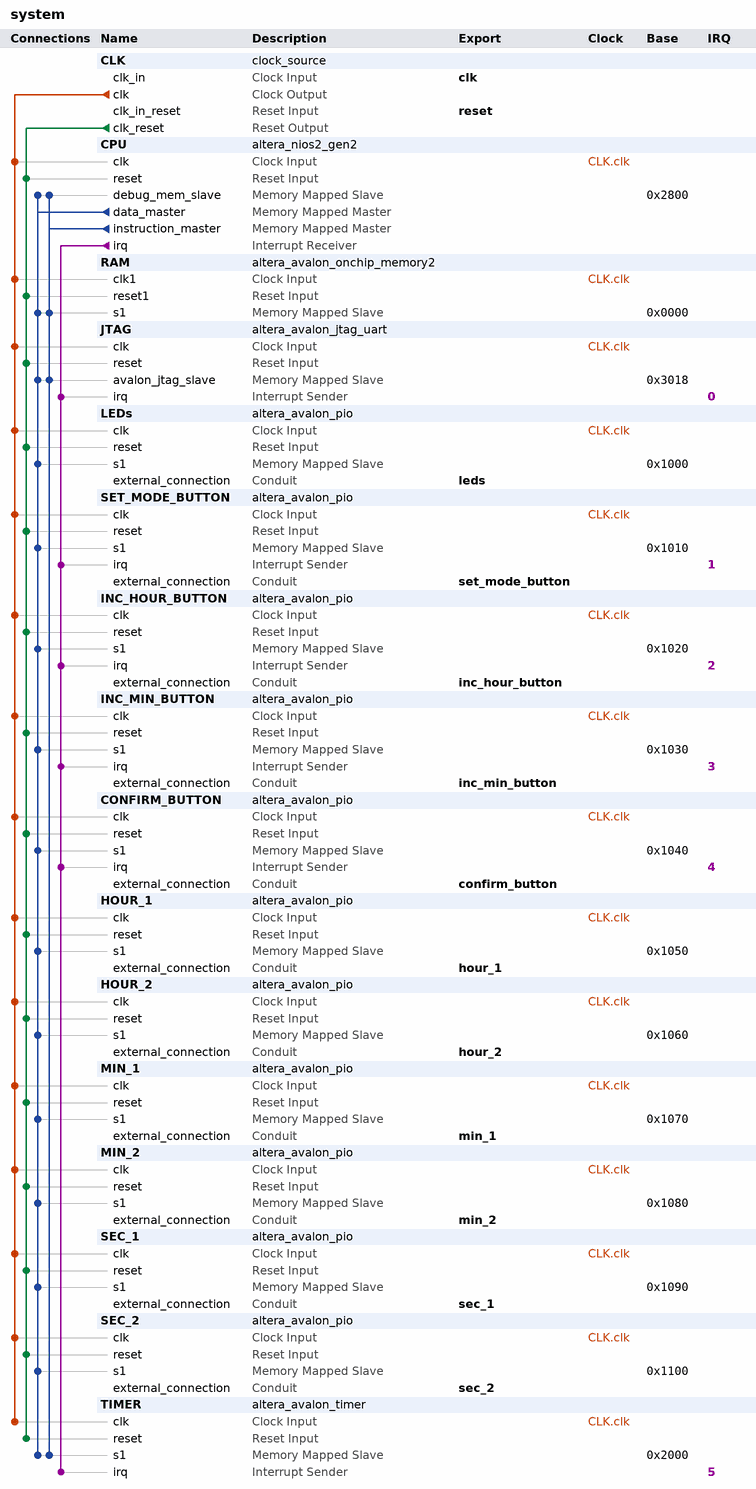
[diagram p0: system contents]
# Platform Designer (Qsys) system system, Cyclone V 5CSEMA5F31C6
# Parameters at their usual value, and those the tool derives, are not listed.
package require -exact qsys 19.1
create_system system
set_project_property DEVICE_FAMILY {Cyclone V}
set_project_property DEVICE 5CSEMA5F31C6

add_instance CLK clock_source 19.1
set_instance_parameter_value CLK clockFrequency 50000000

add_instance CPU altera_nios2_gen2 19.1
set_instance_parameter_value CPU dcache_size 2048
set_instance_parameter_value CPU exceptionSlave RAM.s1
set_instance_parameter_value CPU icache_size 4096
set_instance_parameter_value CPU impl Tiny
set_instance_parameter_value CPU resetSlave RAM.s1

add_instance RAM altera_avalon_onchip_memory2 19.1
set_instance_parameter_value RAM dataWidth 32
set_instance_parameter_value RAM dualPort false
set_instance_parameter_value RAM initMemContent true
set_instance_parameter_value RAM initializationFileName E:/ClockAlarm/software/clock_alarm/mem_init/system_RAM.hex
set_instance_parameter_value RAM memorySize 4096

add_instance JTAG altera_avalon_jtag_uart 19.1
set_instance_parameter_value JTAG simInteractiveOptions NO_INTERACTIVE_WINDOWS

add_instance LEDs altera_avalon_pio 19.1
set_instance_parameter_value LEDs direction Output
set_instance_parameter_value LEDs width 10

add_instance SET_MODE_BUTTON altera_avalon_pio 19.1
set_instance_parameter_value SET_MODE_BUTTON captureEdge true
set_instance_parameter_value SET_MODE_BUTTON direction Input
set_instance_parameter_value SET_MODE_BUTTON edgeType FALLING
set_instance_parameter_value SET_MODE_BUTTON generateIRQ true
set_instance_parameter_value SET_MODE_BUTTON irqType EDGE
set_instance_parameter_value SET_MODE_BUTTON width 1

add_instance INC_HOUR_BUTTON altera_avalon_pio 19.1
set_instance_parameter_value INC_HOUR_BUTTON captureEdge true
set_instance_parameter_value INC_HOUR_BUTTON direction Input
set_instance_parameter_value INC_HOUR_BUTTON edgeType FALLING
set_instance_parameter_value INC_HOUR_BUTTON generateIRQ true
set_instance_parameter_value INC_HOUR_BUTTON irqType EDGE
set_instance_parameter_value INC_HOUR_BUTTON width 1

add_instance INC_MIN_BUTTON altera_avalon_pio 19.1
set_instance_parameter_value INC_MIN_BUTTON captureEdge true
set_instance_parameter_value INC_MIN_BUTTON direction Input
set_instance_parameter_value INC_MIN_BUTTON edgeType FALLING
set_instance_parameter_value INC_MIN_BUTTON generateIRQ true
set_instance_parameter_value INC_MIN_BUTTON irqType EDGE
set_instance_parameter_value INC_MIN_BUTTON width 1

add_instance CONFIRM_BUTTON altera_avalon_pio 19.1
set_instance_parameter_value CONFIRM_BUTTON captureEdge true
set_instance_parameter_value CONFIRM_BUTTON direction Input
set_instance_parameter_value CONFIRM_BUTTON edgeType FALLING
set_instance_parameter_value CONFIRM_BUTTON generateIRQ true
set_instance_parameter_value CONFIRM_BUTTON irqType EDGE
set_instance_parameter_value CONFIRM_BUTTON width 1

add_instance HOUR_1 altera_avalon_pio 19.1
set_instance_parameter_value HOUR_1 direction Output
set_instance_parameter_value HOUR_1 width 7

add_instance HOUR_2 altera_avalon_pio 19.1
set_instance_parameter_value HOUR_2 direction Output
set_instance_parameter_value HOUR_2 width 7

add_instance MIN_1 altera_avalon_pio 19.1
set_instance_parameter_value MIN_1 direction Output
set_instance_parameter_value MIN_1 width 7

add_instance MIN_2 altera_avalon_pio 19.1
set_instance_parameter_value MIN_2 direction Output
set_instance_parameter_value MIN_2 width 7

add_instance SEC_1 altera_avalon_pio 19.1
set_instance_parameter_value SEC_1 direction Output
set_instance_parameter_value SEC_1 width 7

add_instance SEC_2 altera_avalon_pio 19.1
set_instance_parameter_value SEC_2 direction Output
set_instance_parameter_value SEC_2 width 7

add_instance TIMER altera_avalon_timer 19.1
set_instance_parameter_value TIMER alwaysRun true
set_instance_parameter_value TIMER fixedPeriod true
set_instance_parameter_value TIMER period 1
set_instance_parameter_value TIMER periodUnits SEC

# connections
add_connection CLK.clk CONFIRM_BUTTON.clk clock
add_connection CLK.clk CPU.clk clock
add_connection CLK.clk HOUR_1.clk clock
add_connection CLK.clk HOUR_2.clk clock
add_connection CLK.clk INC_HOUR_BUTTON.clk clock
add_connection CLK.clk INC_MIN_BUTTON.clk clock
add_connection CLK.clk JTAG.clk clock
add_connection CLK.clk LEDs.clk clock
add_connection CLK.clk MIN_1.clk clock
add_connection CLK.clk MIN_2.clk clock
add_connection CLK.clk RAM.clk1 clock
add_connection CLK.clk SEC_1.clk clock
add_connection CLK.clk SEC_2.clk clock
add_connection CLK.clk SET_MODE_BUTTON.clk clock
add_connection CLK.clk TIMER.clk clock
add_connection CLK.clk_reset CONFIRM_BUTTON.reset reset
add_connection CLK.clk_reset CPU.reset reset
add_connection CLK.clk_reset HOUR_1.reset reset
add_connection CLK.clk_reset HOUR_2.reset reset
add_connection CLK.clk_reset INC_HOUR_BUTTON.reset reset
add_connection CLK.clk_reset INC_MIN_BUTTON.reset reset
add_connection CLK.clk_reset JTAG.reset reset
add_connection CLK.clk_reset LEDs.reset reset
add_connection CLK.clk_reset MIN_1.reset reset
add_connection CLK.clk_reset MIN_2.reset reset
add_connection CLK.clk_reset RAM.reset1 reset
add_connection CLK.clk_reset SEC_1.reset reset
add_connection CLK.clk_reset SEC_2.reset reset
add_connection CLK.clk_reset SET_MODE_BUTTON.reset reset
add_connection CLK.clk_reset TIMER.reset reset
add_connection CPU.data_master CONFIRM_BUTTON.s1 avalon
set_connection_parameter_value CPU.data_master/CONFIRM_BUTTON.s1 baseAddress 0x1040
add_connection CPU.data_master CPU.debug_mem_slave avalon
set_connection_parameter_value CPU.data_master/CPU.debug_mem_slave baseAddress 0x2800
add_connection CPU.data_master HOUR_1.s1 avalon
set_connection_parameter_value CPU.data_master/HOUR_1.s1 baseAddress 0x1050
add_connection CPU.data_master HOUR_2.s1 avalon
set_connection_parameter_value CPU.data_master/HOUR_2.s1 baseAddress 0x1060
add_connection CPU.data_master INC_HOUR_BUTTON.s1 avalon
set_connection_parameter_value CPU.data_master/INC_HOUR_BUTTON.s1 baseAddress 0x1020
add_connection CPU.data_master INC_MIN_BUTTON.s1 avalon
set_connection_parameter_value CPU.data_master/INC_MIN_BUTTON.s1 baseAddress 0x1030
add_connection CPU.data_master JTAG.avalon_jtag_slave avalon
set_connection_parameter_value CPU.data_master/JTAG.avalon_jtag_slave baseAddress 0x3018
add_connection CPU.data_master LEDs.s1 avalon
set_connection_parameter_value CPU.data_master/LEDs.s1 baseAddress 0x1000
add_connection CPU.data_master MIN_1.s1 avalon
set_connection_parameter_value CPU.data_master/MIN_1.s1 baseAddress 0x1070
add_connection CPU.data_master MIN_2.s1 avalon
set_connection_parameter_value CPU.data_master/MIN_2.s1 baseAddress 0x1080
add_connection CPU.data_master RAM.s1 avalon
set_connection_parameter_value CPU.data_master/RAM.s1 baseAddress 0x0000
add_connection CPU.data_master SEC_1.s1 avalon
set_connection_parameter_value CPU.data_master/SEC_1.s1 baseAddress 0x1090
add_connection CPU.data_master SEC_2.s1 avalon
set_connection_parameter_value CPU.data_master/SEC_2.s1 baseAddress 0x1100
add_connection CPU.data_master SET_MODE_BUTTON.s1 avalon
set_connection_parameter_value CPU.data_master/SET_MODE_BUTTON.s1 baseAddress 0x1010
add_connection CPU.data_master TIMER.s1 avalon
set_connection_parameter_value CPU.data_master/TIMER.s1 baseAddress 0x2000
add_connection CPU.instruction_master CPU.debug_mem_slave avalon
set_connection_parameter_value CPU.instruction_master/CPU.debug_mem_slave baseAddress 0x2800
add_connection CPU.instruction_master JTAG.avalon_jtag_slave avalon
set_connection_parameter_value CPU.instruction_master/JTAG.avalon_jtag_slave baseAddress 0x3018
add_connection CPU.instruction_master RAM.s1 avalon
set_connection_parameter_value CPU.instruction_master/RAM.s1 baseAddress 0x0000
add_connection CPU.instruction_master TIMER.s1 avalon
set_connection_parameter_value CPU.instruction_master/TIMER.s1 baseAddress 0x2000
add_connection CPU.irq CONFIRM_BUTTON.irq interrupt
set_connection_parameter_value CPU.irq/CONFIRM_BUTTON.irq irqNumber 4
add_connection CPU.irq INC_HOUR_BUTTON.irq interrupt
set_connection_parameter_value CPU.irq/INC_HOUR_BUTTON.irq irqNumber 2
add_connection CPU.irq INC_MIN_BUTTON.irq interrupt
set_connection_parameter_value CPU.irq/INC_MIN_BUTTON.irq irqNumber 3
add_connection CPU.irq JTAG.irq interrupt
set_connection_parameter_value CPU.irq/JTAG.irq irqNumber 0
add_connection CPU.irq SET_MODE_BUTTON.irq interrupt
set_connection_parameter_value CPU.irq/SET_MODE_BUTTON.irq irqNumber 1
add_connection CPU.irq TIMER.irq interrupt
set_connection_parameter_value CPU.irq/TIMER.irq irqNumber 5

# exported interfaces
add_interface clk clock sink
set_interface_property clk EXPORT_OF CLK.clk_in
add_interface confirm_button conduit end
set_interface_property confirm_button EXPORT_OF CONFIRM_BUTTON.external_connection
add_interface hour_1 conduit end
set_interface_property hour_1 EXPORT_OF HOUR_1.external_connection
add_interface hour_2 conduit end
set_interface_property hour_2 EXPORT_OF HOUR_2.external_connection
add_interface inc_hour_button conduit end
set_interface_property inc_hour_button EXPORT_OF INC_HOUR_BUTTON.external_connection
add_interface inc_min_button conduit end
set_interface_property inc_min_button EXPORT_OF INC_MIN_BUTTON.external_connection
add_interface leds conduit end
set_interface_property leds EXPORT_OF LEDs.external_connection
add_interface min_1 conduit end
set_interface_property min_1 EXPORT_OF MIN_1.external_connection
add_interface min_2 conduit end
set_interface_property min_2 EXPORT_OF MIN_2.external_connection
add_interface reset reset sink
set_interface_property reset EXPORT_OF CLK.clk_in_reset
add_interface sec_1 conduit end
set_interface_property sec_1 EXPORT_OF SEC_1.external_connection
add_interface sec_2 conduit end
set_interface_property sec_2 EXPORT_OF SEC_2.external_connection
add_interface set_mode_button conduit end
set_interface_property set_mode_button EXPORT_OF SET_MODE_BUTTON.external_connection

set_interconnect_requirement {$system} qsys_mm.clockCrossingAdapter HANDSHAKE
set_interconnect_requirement {$system} qsys_mm.enableEccProtection FALSE
set_interconnect_requirement {$system} qsys_mm.insertDefaultSlave FALSE
set_interconnect_requirement {$system} qsys_mm.maxAdditionalLatency 1

save_system system.qsys
